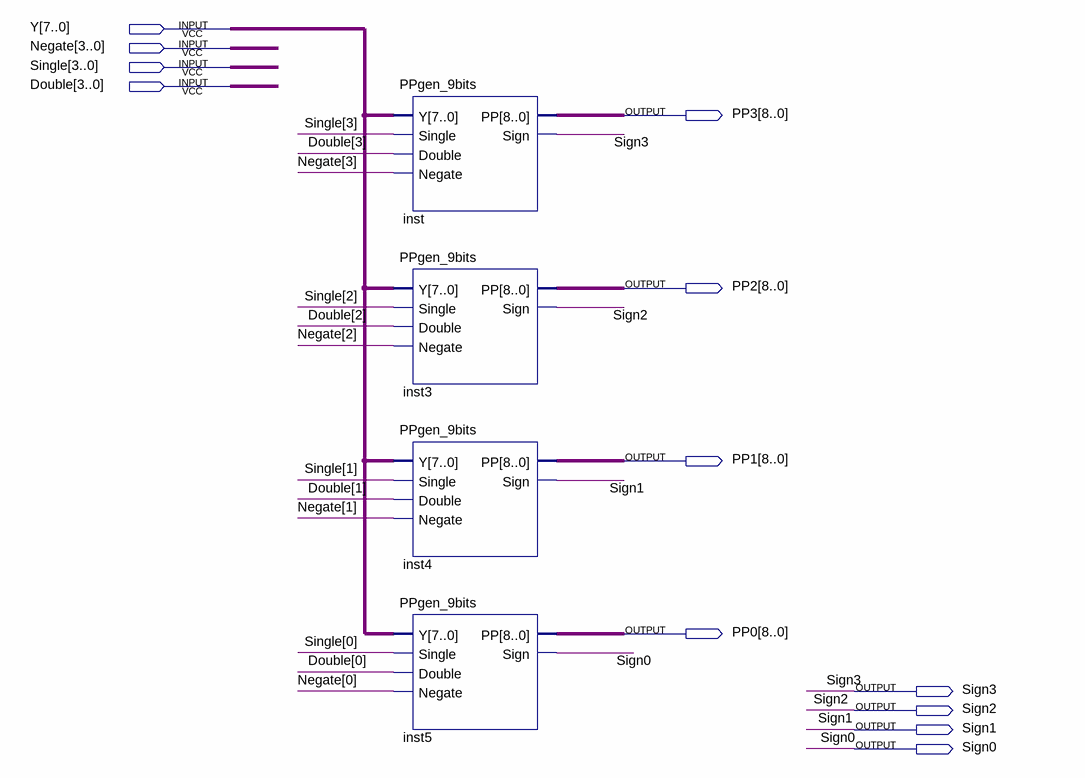
[diagram p0: schematic sheet]
// Quartus schematic PPgen_wordslice.bdf as structural Verilog: 4 symbols, 12 pins
module PPgen_wordslice (
  input  [7:0] Y,
  input  [3:0] Negate,
  input  [3:0] Single,
  input  [3:0] Double,
  output [8:0] PP3,
  output [8:0] PP2,
  output [8:0] PP1,
  output [8:0] PP0,
  output Sign3,
  output Sign2,
  output Sign1,
  output Sign0
);

  PPgen_9bits inst (.Y(Y), .Single(Single[3]), .Double(Double[3]), .Negate(Negate[3]), .PP(PP3), .Sign(Sign3));
  PPgen_9bits inst3 (.Y(Y), .Single(Single[2]), .Double(Double[2]), .Negate(Negate[2]), .PP(PP2), .Sign(Sign2));
  PPgen_9bits inst4 (.Y(Y), .Single(Single[1]), .Double(Double[1]), .Negate(Negate[1]), .PP(PP1), .Sign(Sign1));
  PPgen_9bits inst5 (.Y(Y), .Single(Single[0]), .Double(Double[0]), .Negate(Negate[0]), .PP(PP0), .Sign(Sign0));
endmodule
